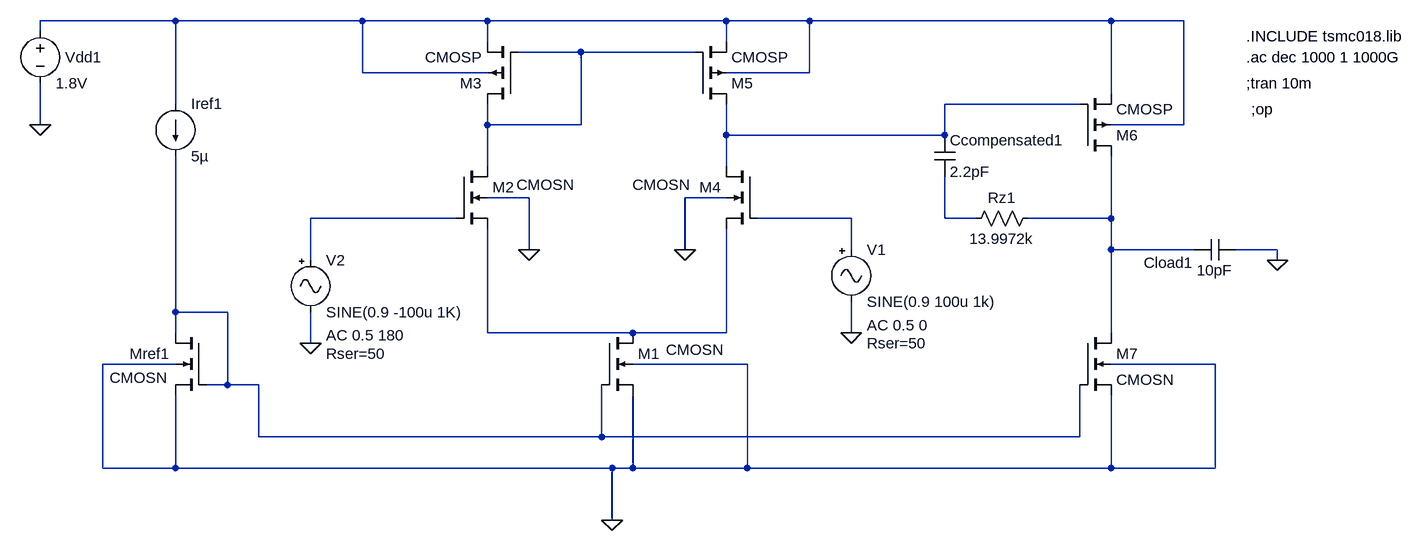
[diagram p0: schematic 2_STAGE_OTA_OPEN_LOOP_ADITYATRIVED.asc]
2_STAGE_OTA_OPEN_LOOP_ADITYATRIVED.asc, the LTspice schematic file:
Version 4
SHEET 1 880 680
WIRE -1456 -800 -1664 -800
WIRE -1168 -800 -1456 -800
WIRE -976 -800 -1168 -800
WIRE -608 -800 -976 -800
WIRE -480 -800 -608 -800
WIRE -16 -800 -480 -800
WIRE 96 -800 -16 -800
WIRE -1664 -784 -1664 -800
WIRE -976 -768 -976 -800
WIRE -608 -768 -608 -800
WIRE -832 -752 -928 -752
WIRE -656 -752 -832 -752
WIRE -1168 -720 -1168 -800
WIRE -976 -720 -1168 -720
WIRE -480 -720 -480 -800
WIRE -480 -720 -608 -720
WIRE -16 -688 -16 -800
WIRE -1456 -672 -1456 -800
WIRE -112 -672 -272 -672
WIRE -64 -672 -112 -672
WIRE -1664 -640 -1664 -704
WIRE -976 -640 -976 -672
WIRE -832 -640 -832 -752
WIRE -832 -640 -976 -640
WIRE 96 -640 96 -800
WIRE 96 -640 -16 -640
WIRE -608 -624 -608 -672
WIRE -272 -624 -272 -672
WIRE -272 -624 -608 -624
WIRE -976 -576 -976 -640
WIRE -608 -576 -608 -624
WIRE -912 -528 -976 -528
WIRE -608 -528 -672 -528
WIRE -16 -528 -16 -592
WIRE -1024 -496 -1248 -496
WIRE -416 -496 -560 -496
WIRE -272 -496 -272 -560
WIRE -224 -496 -272 -496
WIRE -16 -496 -16 -528
WIRE -16 -496 -144 -496
WIRE -912 -448 -912 -528
WIRE -672 -448 -672 -528
WIRE -416 -448 -416 -496
WIRE -16 -448 -16 -496
WIRE 112 -448 -16 -448
WIRE 240 -448 176 -448
WIRE -1248 -432 -1248 -496
WIRE 240 -432 240 -448
WIRE -1456 -400 -1456 -592
WIRE -1456 -352 -1456 -400
WIRE -1376 -352 -1456 -352
WIRE -1456 -320 -1456 -352
WIRE -976 -320 -976 -480
WIRE -800 -320 -976 -320
WIRE -752 -320 -800 -320
WIRE -608 -320 -608 -480
WIRE -608 -320 -752 -320
WIRE -416 -320 -416 -368
WIRE -16 -320 -16 -448
WIRE -1248 -304 -1248 -352
WIRE -1456 -272 -1568 -272
WIRE -576 -272 -752 -272
WIRE 144 -272 -16 -272
WIRE -1376 -240 -1376 -352
WIRE -1376 -240 -1408 -240
WIRE -1328 -240 -1376 -240
WIRE -1328 -160 -1328 -240
WIRE -880 -160 -1328 -160
WIRE -800 -160 -800 -240
WIRE -800 -160 -880 -160
WIRE -128 -160 -800 -160
WIRE -64 -160 -64 -240
WIRE -64 -160 -128 -160
WIRE -1568 -112 -1568 -272
WIRE -1456 -112 -1456 -224
WIRE -1456 -112 -1568 -112
WIRE -784 -112 -1456 -112
WIRE -752 -112 -752 -224
WIRE -752 -112 -784 -112
WIRE -576 -112 -576 -272
WIRE -576 -112 -752 -112
WIRE -16 -112 -16 -224
WIRE -16 -112 -576 -112
WIRE 144 -112 144 -272
WIRE 144 -112 -16 -112
WIRE -784 -32 -784 -112
FLAG -784 -32 0
FLAG -1664 -640 0
FLAG -912 -448 0
FLAG -672 -448 0
FLAG -416 -320 0
FLAG -1248 -304 0
FLAG 240 -432 0
DATAFLAG -608 -624 ""
DATAFLAG -800 -320 ""
DATAFLAG -832 -752 ""
DATAFLAG -112 -672 ""
DATAFLAG -128 -160 ""
DATAFLAG -880 -160 ""
DATAFLAG -1456 -400 ""
DATAFLAG -976 -640 ""
DATAFLAG -16 -528 ""
SYMBOL cmosn -800 -320 R0
WINDOW 3 99 26 Left 2
SYMATTR InstName M1
SYMATTR Value2 l=1u w=8.5u
SYMBOL cmosn -1024 -576 R0
WINDOW 3 93 28 Left 2
SYMATTR InstName M2
SYMATTR Value2 l=1u w=9u
SYMBOL cmosp -928 -672 R180
SYMATTR InstName M3
SYMATTR Value2 l=1u w=1.12u
SYMBOL cmosn -560 -576 M0
WINDOW 3 103 28 Left 2
SYMATTR InstName M4
SYMATTR Value2 l=1u w=9u
SYMBOL cmosp -656 -672 M180
SYMATTR InstName M5
SYMATTR Value2 l=1u w=1.12u
SYMBOL cmosn -1408 -320 M0
WINDOW 3 60 69 Left 2
SYMATTR InstName Mref1
SYMATTR Value2 l=1u w=2u
SYMBOL current -1456 -672 R0
WINDOW 123 0 0 Left 2
WINDOW 39 0 0 Left 2
SYMATTR InstName Iref1
SYMATTR Value 5µ
SYMBOL voltage -1664 -800 R0
WINDOW 123 0 0 Left 2
WINDOW 39 0 0 Left 2
WINDOW 0 38 56 Left 2
SYMATTR InstName Vdd1
SYMATTR Value 1.8V
SYMBOL cmosp -64 -592 M180
SYMATTR InstName M6
SYMATTR Value2 l=1u w=7.138u
SYMBOL cmosn -64 -320 R0
SYMATTR InstName M7
SYMATTR Value2 l=1u w=25u
SYMBOL res -128 -512 R90
WINDOW 0 0 56 VBottom 2
WINDOW 3 32 56 VTop 2
SYMATTR InstName Rz1
SYMATTR Value 13.9972k
SYMBOL Misc\\signal -416 -464 R0
WINDOW 123 24 132 Left 2
WINDOW 39 24 160 Left 2
SYMATTR InstName V1
SYMATTR Value SINE(0.9 100u 1k)
SYMATTR Value2 AC 0.5 0
SYMATTR SpiceLine Rser=50
SYMBOL cap -288 -624 R0
SYMATTR InstName Ccompensated1
SYMATTR Value 2.2pF
SYMBOL Misc\\signal -1248 -448 R0
WINDOW 123 24 132 Left 2
WINDOW 39 24 160 Left 2
SYMATTR InstName V2
SYMATTR Value SINE(0.9 -100u 1K)
SYMATTR Value2 AC 0.5 180
SYMATTR SpiceLine Rser=50
SYMBOL cap 176 -464 R90
WINDOW 0 52 103 VBottom 2
WINDOW 3 32 32 VTop 2
SYMATTR InstName Cload1
SYMATTR Value 10pF
TEXT 192 -776 Left 2 !.INCLUDE tsmc018.lib
TEXT 192 -704 Left 2 !;tran 10m
TEXT 192 -744 Left 2 !.ac dec 1000 1 1000G
TEXT 200 -664 Left 2 !;op

The netlist it stands for:
* 2_STAGE_OTA_OPEN_LOOP_ADITYATRIVED.asc
M1 N009 N008 0 0 CMOSN l=1u w=8.5u
M2 N002 N005 N009 0 CMOSN l=1u w=9u
M3 N002 N002 N001 N001 CMOSP l=1u w=1.12u
M4 N003 N006 N009 0 CMOSN l=1u w=9u
M5 N003 N002 N001 N001 CMOSP l=1u w=1.12u
Mref1 N008 N008 0 0 CMOSN l=1u w=2u
Iref1 N001 N008 5µ
Vdd1 N001 0 1.8V
M6 N004 N003 N001 N001 CMOSP l=1u w=7.138u
M7 N004 N008 0 0 CMOSN l=1u w=25u
Rz1 N004 N007 13.9972k
V1 N006 0 SINE(0.9 100u 1k) AC 0.5 0 Rser=50
Ccompensated1 N003 N007 2.2pF
V2 N005 0 SINE(0.9 -100u 1K) AC 0.5 180 Rser=50
Cload1 0 N004 10pF
.model NMOS NMOS
.model PMOS PMOS
.lib standard.mos
.INCLUDE tsmc018.lib
;tran 10m
.ac dec 1000 1 1000G
;op
.backanno
.end